# Altium schematic sheet hv_io_main_connector.SchDoc
size A4; Organization: Badgerloop; Address1: 133 Engineering Research; Address2: Building; Address3: Madison, WI 53715
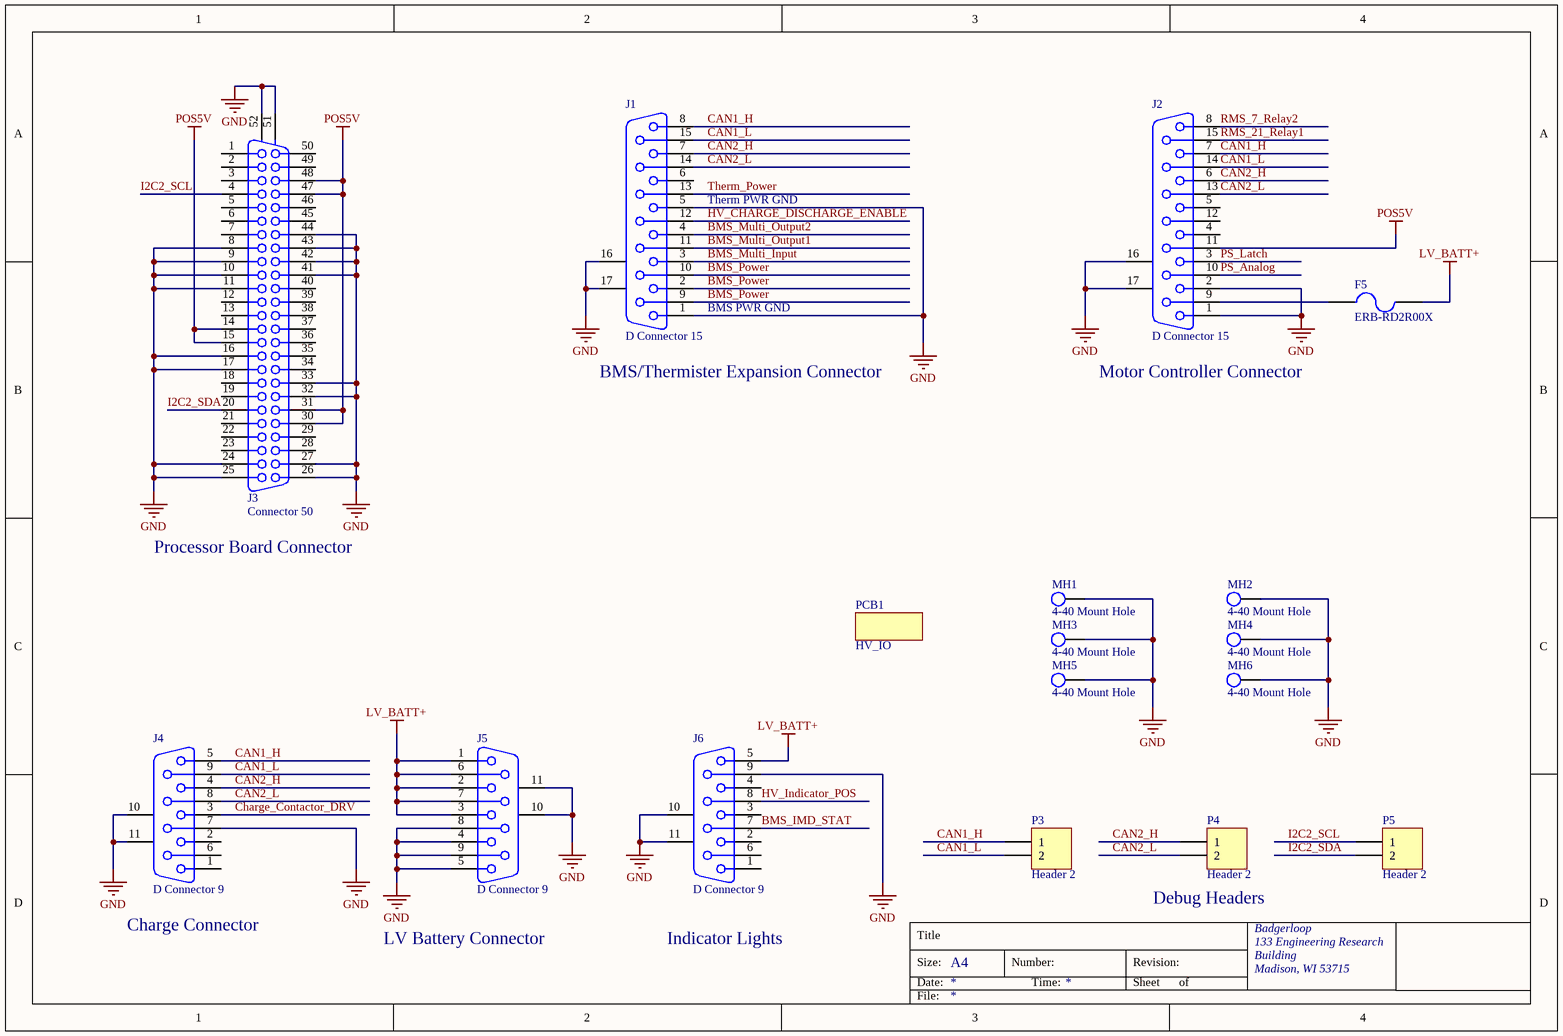
[diagram p0: hv_io_main_connector.SchDoc]

## Parts
F5  ERB-RD2R00X  [SMD-0402-RES]
J1  D Connector 15  [DSUB1.385-2H15]
J2  D Connector 15  [DSUB1.385-2H15]
J3  Connector 50  [050DSUB1.27-H96]
J4  D Connector 9  [DSUB1.385-2H9]
J5  D Connector 9  [DSUB1.385-2H9]
J6  D Connector 9  [DSUB1.385-2H9]
MH1  4-40 Mount Hole  [MH]
MH2  4-40 Mount Hole  [MH]
MH3  4-40 Mount Hole  [MH]
MH4  4-40 Mount Hole  [MH]
MH5  4-40 Mount Hole  [MH]
MH6  4-40 Mount Hole  [MH]
P3  Header 2  [Pin Header 1x2 TH Pitch 2.54mm]
P4  Header 2  [Pin Header 1x2 TH Pitch 2.54mm]
P5  Header 2  [Pin Header 1x2 TH Pitch 2.54mm]
PCB1  HV_IO  [PCB]

## Nets
GND: J1.1 J1.5 J1.16(MH1) J1.17(MH2) J2.1 J2.2 J2.16(MH1) J2.17(MH2) J3.8 J3.9 J3.10 J3.11 J3.16 J3.17 J3.24 J3.25 J3.26 J3.27 J3.32 J3.33 J3.41 J3.42 J3.43 J3.44 J3.51 J3.52 J4.7 J4.10(MH1) J4.11(MH2) J5.4 J5.5 J5.8 J5.9 J5.10(MH1) J5.11(MH2) J6.9 J6.10(MH1) J6.11(MH2) MH1.46 MH2.46 MH3.46 MH4.46 MH5.46 MH6.46
LV_BATT+: F5.2 J5.1 J5.2 J5.3 J5.6 J5.7 J6.5
POS5V: J2.11 J3.14 J3.15 J3.30 J3.31 J3.47 J3.48
BMS_IMD_STAT: J6.7
BMS_Multi_Input: J1.3
BMS_Multi_Output1: J1.11
BMS_Multi_Output2: J1.4
BMS_Power: J1.2 J1.9 J1.10
CAN1_H: J1.8 J2.7 J4.5 P3.1
CAN1_L: J1.15 J2.14 J4.9 P3.2
CAN2_H: J1.7 J2.6 J4.4 P4.1
CAN2_L: J1.14 J2.13 J4.8 P4.2
Charge_Contactor_DRV: J4.3
HV_CHARGE_DISCHARGE_ENABLE: J1.12
HV_Indicator_POS: J6.8
I2C2_SCL: J3.4 P5.1
I2C2_SDA: J3.20 P5.2
PS_Analog: J2.10
PS_Latch: J2.3
RMS_7_Relay2: J2.8
RMS_21_Relay1: J2.15
Therm_Power: J1.13
NetF5_1: F5.1 J2.9

Not connected (* = marked no-connect by the designer): J1 6; J2 4 5 12; J3 1 2 3 5 6 7 12 13 18 19 21 22 23 28 29 34 35 36 37 38 39 40 45 46 49 50; J4 1 2 6; J6 1 2 3 4 6

## Notes on the sheet
- (near J1) Therm PWR GND
- (near J1) BMS PWR GND
- (near J1) BMS/Thermister Expansion Connector
- Motor Controller Connector
- Processor Board Connector
- (near P4) Debug Headers
- (near J4) Charge Connector
- LV Battery Connector
- Indicator Lights
- Title
- Size:
- Date:
- A4
- Number:
- Time:
- Revision:
- Sheet
- of
- File:

## Library data of the parts
F5 = ERB-RD2R00X: FUSE BOARD MOUNT 2A 32VDC 0402; Manufacturer: Panasonic; Manufacturer P/N: ERB-RD2R00X; Digikey P/N: P15123TR-ND; Digikey Link: https://www.digikey.com/product-detail/en/panasonic-electronic-components/ERB-RD2R00X/P15123TR-ND/2796785
J1 J2 = D Connector 15: Receptacle Assembly, 15 Position, Right Angle; PackageDocument: O; Positions: 15; Published: 15-Jun-2001; LatestRevisionDate: 17-Jul-2002; LatestRevisionNote: Re-released for DXP Platform.; DatasheetDocument: 1-Sep-99; PackageReference: 788757; Publisher: Altium Limited; Orientation: Right Angle; Gender: Receptacle
J3 = Connector 50: Plug Header Assembly; Manufacturer: HARTING; Manufacturer P/N: 09665627811; Digikey Link: https://www.digikey.com/product-detail/en/harting/09665627811/1195-5057-ND/4322749; Digikey P/N: 1195-5057-ND
J4-J6 = D Connector 9: Receptacle Assembly, 9 Position, Right Angle; PackageDocument: O; Positions: 9; Published: 15-Jun-2001; LatestRevisionDate: 17-Jul-2002; LatestRevisionNote: Re-released for DXP Platform.; DatasheetDocument: 1-Sep-1999; PackageReference: 788750; Publisher: Altium Limited; Orientation: Right Angle; Gender: Receptacle
P3-P5 = Header 2: Header, 2-Pin; LatestRevisionDate: 17-Jul-2002; LatestRevisionNote: Re-released for DXP Platform.; Publisher: Altium Limited
PCB1 = PCB